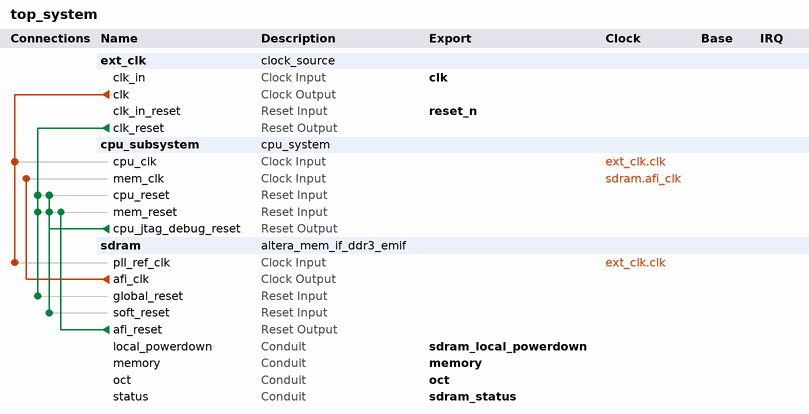
[diagram p0: system contents]
# Platform Designer (Qsys) system top_system
# Parameters at their usual value, and those the tool derives, are not listed.
package require -exact qsys 11.0
create_system top_system
set_project_property DEVICE_FAMILY STRATIXIV

add_instance ext_clk clock_source 11.0
set_instance_parameter_value ext_clk clockFrequency 100000000

add_instance cpu_subsystem cpu_system 1.0

add_instance sdram altera_mem_if_ddr3_emif 11.0
set_instance_parameter_value sdram MEM_VENDOR Micron
set_instance_parameter_value sdram MEM_FORMAT DISCRETE
set_instance_parameter_value sdram MEM_CLK_FREQ_MAX 666.667
set_instance_parameter_value sdram MEM_ROW_ADDR_WIDTH 13
set_instance_parameter_value sdram MEM_COL_ADDR_WIDTH 10
set_instance_parameter_value sdram MEM_DQ_WIDTH 8
set_instance_parameter_value sdram MEM_BANKADDR_WIDTH 3
set_instance_parameter_value sdram ALLOW_BIDIR_MEM_CK false
set_instance_parameter_value sdram MEM_DRV_STR RZQ/6
set_instance_parameter_value sdram MEM_RTT_NOM RZQ/4
set_instance_parameter_value sdram MEM_RTT_WR {Dynamic ODT off}
set_instance_parameter_value sdram MEM_WTCL 6
set_instance_parameter_value sdram MEM_TCL 7
set_instance_parameter_value sdram TIMING_TIS 190
set_instance_parameter_value sdram TIMING_TIH 140
set_instance_parameter_value sdram TIMING_TDS 30
set_instance_parameter_value sdram TIMING_TDH 65
set_instance_parameter_value sdram TIMING_TDQSQ 125
set_instance_parameter_value sdram TIMING_TDQSCK 255
set_instance_parameter_value sdram TIMING_TDQSS 0.25
set_instance_parameter_value sdram TIMING_TQSH 0.4
set_instance_parameter_value sdram TIMING_TDSH 0.2
set_instance_parameter_value sdram TIMING_TDSS 0.2
set_instance_parameter_value sdram MEM_TRAS_NS 36.0
set_instance_parameter_value sdram MEM_TRCD_NS 13.5
set_instance_parameter_value sdram MEM_TRP_NS 13.5
set_instance_parameter_value sdram MEM_TRFC_NS 110.0
set_instance_parameter_value sdram MEM_TWTR 4
set_instance_parameter_value sdram MEM_TFAW_NS 30.0
set_instance_parameter_value sdram MEM_TRRD_NS 6.0
set_instance_parameter_value sdram MEM_TRTP_NS 7.5
set_instance_parameter_value sdram POWER_OF_TWO_BUS false
set_instance_parameter_value sdram AVL_MAX_SIZE 2
set_instance_parameter_value sdram BYTE_ENABLE false
set_instance_parameter_value sdram CFG_REORDER_DATA false
set_instance_parameter_value sdram REF_CLK_FREQ 100.0
set_instance_parameter_value sdram DLL_DELAY_CHAIN_LENGTH 10
set_instance_parameter_value sdram DEFAULT_FAST_SIM_MODEL true
set_instance_parameter_value sdram QSYS_SEQUENCER_DEBUG true
set_instance_parameter_value sdram PLL_LOCATION Top_Bottom
set_instance_parameter_value sdram CALIBRATION_MODE Skip
set_instance_parameter_value sdram DQS_TRK_ENABLED false
set_instance_parameter_value sdram TIMING_BOARD_MAX_CK_DELAY 0.6
set_instance_parameter_value sdram TIMING_BOARD_MAX_DQS_DELAY 0.6
set_instance_parameter_value sdram TIMING_BOARD_SKEW_CKDQS_DIMM_MIN -0.01
set_instance_parameter_value sdram TIMING_BOARD_SKEW_CKDQS_DIMM_MAX 0.01
set_instance_parameter_value sdram TIMING_BOARD_SKEW_WITHIN_DQS 0.02
set_instance_parameter_value sdram TIMING_BOARD_SKEW_BETWEEN_DQS 0.02
set_instance_parameter_value sdram TIMING_BOARD_DQ_TO_DQS_SKEW 0.0
set_instance_parameter_value sdram TIMING_BOARD_AC_SKEW 0.02
set_instance_parameter_value sdram TIMING_BOARD_AC_TO_CK_SKEW 0.0
set_instance_parameter_value sdram RATE Half
set_instance_parameter_value sdram MEM_CLK_FREQ 533.0
set_instance_parameter_value sdram SPEED_GRADE 2
set_instance_parameter_value sdram ENABLE_ABS_RAM_MEM_INIT true

# connections
add_connection ext_clk.clk cpu_subsystem.cpu_clk clock
add_connection ext_clk.clk sdram.pll_ref_clk clock
add_connection sdram.afi_clk cpu_subsystem.mem_clk clock
add_connection cpu_subsystem.cpu_jtag_debug_reset cpu_subsystem.cpu_reset reset
add_connection cpu_subsystem.cpu_jtag_debug_reset cpu_subsystem.mem_reset reset
add_connection cpu_subsystem.cpu_jtag_debug_reset sdram.soft_reset reset
add_connection ext_clk.clk_reset cpu_subsystem.cpu_reset reset
add_connection ext_clk.clk_reset cpu_subsystem.mem_reset reset
add_connection ext_clk.clk_reset sdram.global_reset reset
add_connection sdram.afi_reset cpu_subsystem.mem_reset reset

# exported interfaces
add_interface clk clock sink
set_interface_property clk EXPORT_OF ext_clk.clk_in
add_interface reset_n reset sink
set_interface_property reset_n EXPORT_OF ext_clk.clk_in_reset
add_interface memory conduit end
set_interface_property memory EXPORT_OF sdram.memory
add_interface oct conduit end
set_interface_property oct EXPORT_OF sdram.oct
add_interface sdram_status conduit end
set_interface_property sdram_status EXPORT_OF sdram.status
add_interface sdram_local_powerdown conduit end
set_interface_property sdram_local_powerdown EXPORT_OF sdram.local_powerdown

save_system top_system.qsys
